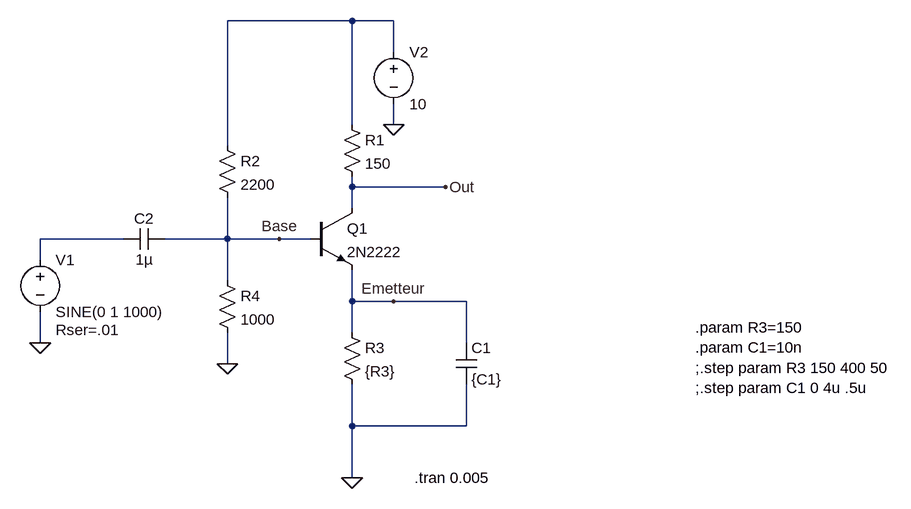
[diagram p0: schematic NPN-Simple1.asc]
NPN-Simple1.asc, the LTspice schematic file:
Version 4
SHEET 1 1268 680
WIRE 400 -224 208 -224
WIRE 464 -224 400 -224
WIRE 464 -176 464 -224
WIRE 400 -64 400 -224
WIRE 464 -64 464 -96
WIRE 208 -32 208 -224
WIRE 400 32 400 16
WIRE 544 32 400 32
WIRE 400 64 400 32
WIRE 48 112 -80 112
WIRE 208 112 208 48
WIRE 208 112 112 112
WIRE 288 112 208 112
WIRE 336 112 288 112
WIRE -80 144 -80 112
WIRE 208 176 208 112
WIRE 400 208 400 160
WIRE 464 208 400 208
WIRE 576 208 464 208
WIRE 400 256 400 208
WIRE -80 272 -80 224
WIRE 576 272 576 208
WIRE 208 304 208 256
WIRE 400 400 400 336
WIRE 576 400 576 336
WIRE 576 400 400 400
WIRE 400 480 400 400
FLAG -80 272 0
FLAG 400 480 0
FLAG 464 -64 0
FLAG 544 32 Out
FLAG 288 112 Base
FLAG 464 208 Emetteur
FLAG 208 304 0
SYMBOL voltage -80 128 R0
WINDOW 123 0 0 Left 0
WINDOW 39 24 124 Left 2
SYMATTR SpiceLine Rser=.01
SYMATTR InstName V1
SYMATTR Value SINE(0 1 1000)
SYMBOL voltage 464 -192 R0
WINDOW 123 0 0 Left 0
WINDOW 39 0 0 Left 0
SYMATTR InstName V2
SYMATTR Value 10
SYMBOL res 384 -80 R0
SYMATTR InstName R1
SYMATTR Value 150
SYMBOL npn 336 64 R0
SYMATTR InstName Q1
SYMATTR Value 2N2222
SYMBOL res 384 240 R0
SYMATTR InstName R3
SYMATTR Value {R3}
SYMBOL cap 560 272 R0
SYMATTR InstName C1
SYMATTR Value {C1}
SYMBOL cap 112 96 R90
WINDOW 0 0 32 VBottom 2
WINDOW 3 32 32 VTop 2
SYMATTR InstName C2
SYMATTR Value 1µ
SYMBOL res 192 -48 R0
SYMATTR InstName R2
SYMATTR Value 2200
SYMBOL res 192 160 R0
SYMATTR InstName R4
SYMATTR Value 1000
TEXT 496 480 Left 2 !.tran 0.005
TEXT 928 248 Left 2 !.param R3=150\n.param C1=10n\n;.step param R3 150 400 50\n;.step param C1 0 4u .5u

The netlist it stands for:
* NPN-Simple1.asc
V1 N002 0 SINE(0 1 1000) Rser=.01
V2 N001 0 10
R1 N001 Out 150
Q1 Out Base Emetteur 0 2N2222
R3 Emetteur 0 {R3}
C1 Emetteur 0 {C1}
C2 Base N002 1µ
R2 N001 Base 2200
R4 Base 0 1000
.model NPN NPN
.model PNP PNP
.lib standard.bjt
.tran 0.005
.param R3=150
.param C1=10n
;.step param R3 150 400 50
;.step param C1 0 4u .5u
.backanno
.end